# EasyEDA Pro project 魔方机器人 2.eprj

# Schematic 原理图
Create Date: 2024-04-21; Page Name: P1; Project Name: 魔方机器人 2; Schematic Name: 原理图; Update Date: 2024-06-26; Company: 广东海洋大学; Drawed: 何云峰; Page Size: A4; Version: V1.0
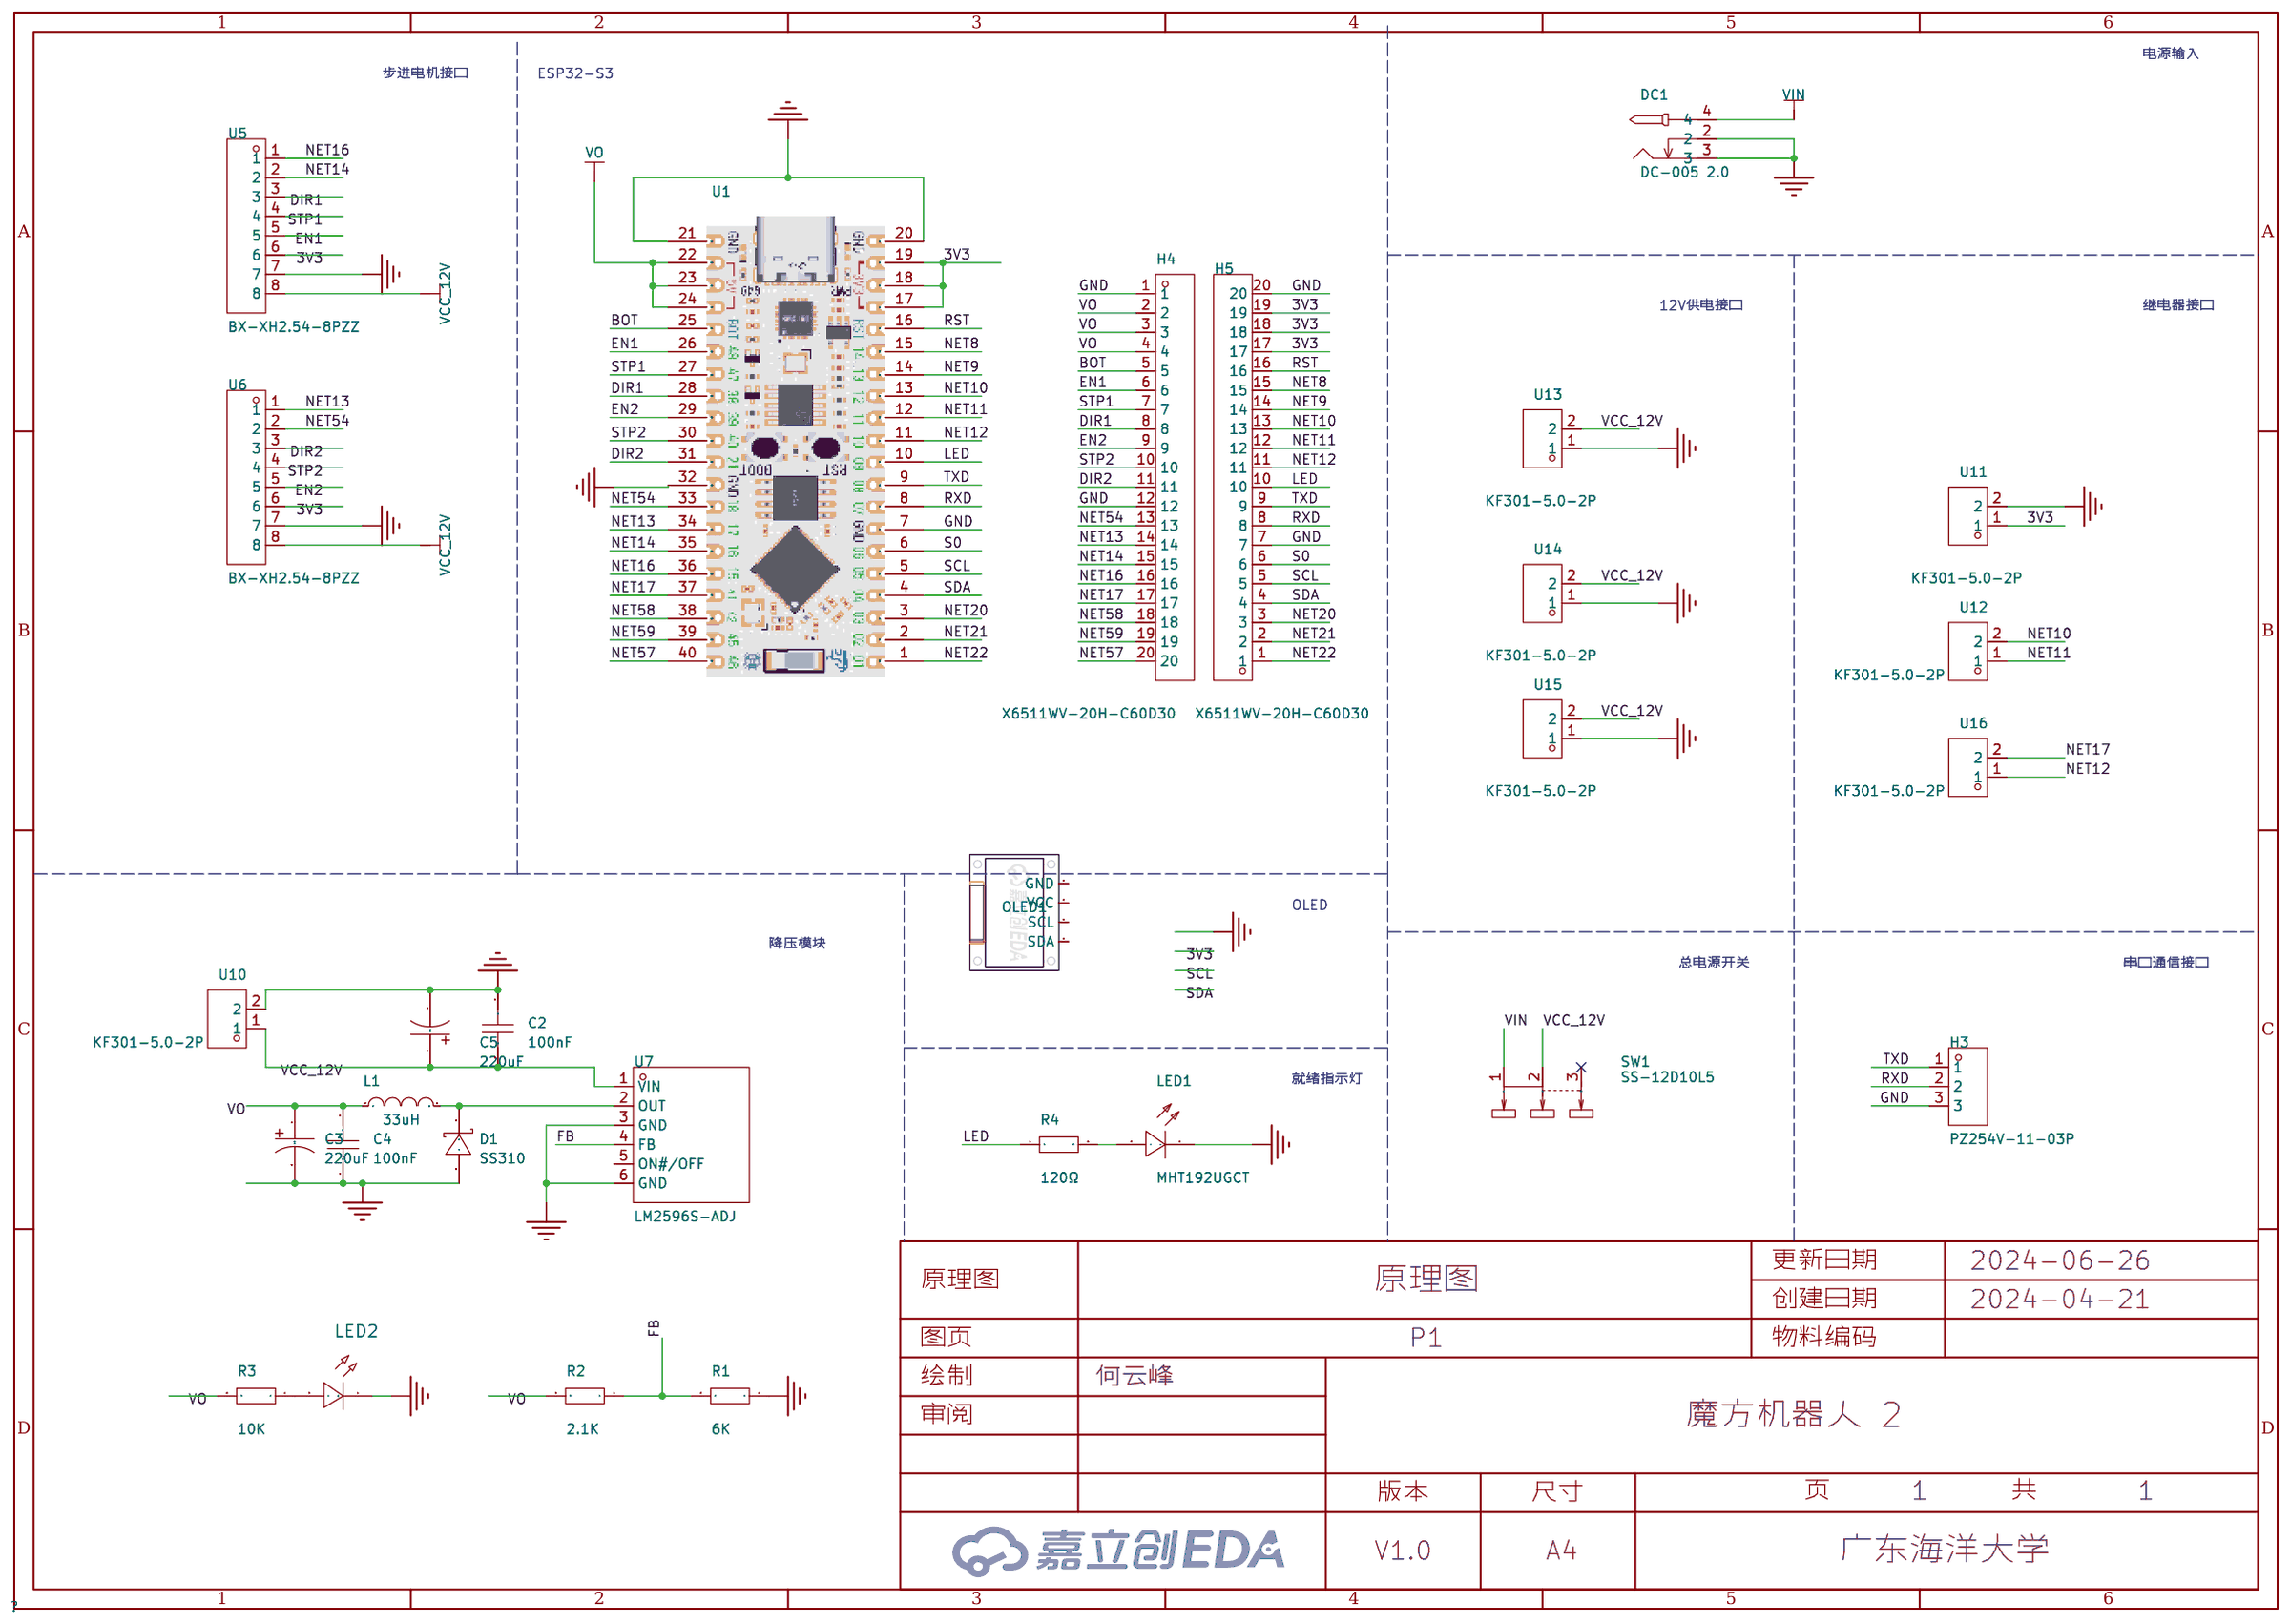
[diagram p0: schematic sheet]

## Parts
C2  100nF  [C0805]
C3  220uF  [CAP-SMD_BD8.0-L8.3-W8.3-FD]
C4  100nF  [C0805]
C5  220uF  [CAP-SMD_BD8.0-L8.3-W8.3-FD]
D1  SS310  [SMA_L4.3-W2.6-LS5.2-RD]
DC1  DC-005 2.0  [DC-IN-TH_DC-5520-1]
H3  PZ254V-11-03P  [HDR-TH_3P-P2.54-V-M]
H4  X6511WV-20H-C60D30  [HDR-TH_20P-P2.54-V-M]
H5  X6511WV-20H-C60D30  [HDR-TH_20P-P2.54-V-M]
L1  33uH  [IND-SMD_L7.0-W6.6_FXL0630]
LED1  MHT192UGCT  [LED0603-RD_GREEN]
LED2  -  [LED_0805]
OLED1  -  [0.96OLED_4P]
R1  6K  [R0805]
R2  2.1K  [R0805]
R3  10K  [R0805]
R4  120Ω  [R0603]
SW1  SS-12D10L5  [SW-TH_SS-12D10L5]
U1  -  [DIP-40_L20.32-W51.66-P2.54-LS15.24_OLD]
U5  BX-XH2.54-8PZZ  [CONN-TH_8P-P2.50_BX-XH2.54-8PZZ]
U6  BX-XH2.54-8PZZ  [CONN-TH_8P-P2.50_BX-XH2.54-8PZZ]
U7  LM2596S-ADJ  [TO-263-5_L10.2-W8.6-P1.70-LS14.4-BR]
U10  KF301-5.0-2P  [CONN-TH_P5.00_KF301-5.0-2P]
U11  KF301-5.0-2P  [CONN-TH_P5.00_KF301-5.0-2P]
U12  KF301-5.0-2P  [CONN-TH_P5.00_KF301-5.0-2P]
U13  KF301-5.0-2P  [CONN-TH_P5.00_KF301-5.0-2P]
U14  KF301-5.0-2P  [CONN-TH_P5.00_KF301-5.0-2P]
U15  KF301-5.0-2P  [CONN-TH_P5.00_KF301-5.0-2P]
U16  KF301-5.0-2P  [CONN-TH_P5.00_KF301-5.0-2P]

## Library data of the parts
C2 C4 = CAP_0805: Supplier Footprint: 0805
C3 C5 = EEEFP1V221AP: 容值:220uF;精度:±20%;额定电压:35V;电容体直径:8mm;电容体长度:10.2mm;纹波电流:-;等效串联电阻:-;工作寿命:2000hrs@105℃;工作温度:-45℃~+105℃;; LCSC Part Name: 220uF ±20% 35V; Supplier Part: C278406; Manufacturer: PANASONIC(松下); Supplier Footprint: SMD,8x10.2mm; JLCPCB Part Class: Extended Part; Datasheet: https://atta.szlcsc.com/upload/public/pdf/source/20181130/C278406_CB9CD87BC4579E70B6A89BF3334E5E7E.pdf; Supplier: LCSC; Tolerance: ±20%; Rated Voltage: 35V; φD: 8mm; L: 10.2mm; Lifetime @ Temp: 2000hrs@105℃; Operating Temperature: -45℃~+105℃
D1 = SS310_C15874: 直流反向耐压(Vr):100V;平均整流电流(Io):3A;正向压降(Vf):850mV@3A;; LCSC Part Name: 100V3A850mV@3A; Supplier Part: C15874; Manufacturer: MDD; Supplier Footprint: SMA(DO-214AC); JLCPCB Part Class: ExtendedPart; Datasheet: https://atta.szlcsc.com/upload/public/pdf/source/20230314/A80AE34493C69B89E2F4B1712F433538.pdf; Supplier: LCSC; Reverse Voltage (Vr): 100V; Average Rectified Current (Io): 3A; Forward Voltage (Vf@If): 850mV@3A
DC1 = DC-005 2.0: 连接器类型:DC电源插座;安装方式:弯插;触点内径:2mm;触点外径:6.4mm;额定电流:-;额定电压:-;工作温度范围:-;; LCSC Part Name: DC电源插座 内径:2mm 外径:6.4mm; Supplier Part: C16214; Manufacturer: BOOMELE(博穆精密); Supplier Footprint: 插件; JLCPCB Part Class: 扩展库; Datasheet: https://atta.szlcsc.com/upload/public/pdf/source/20230822/A395081E7D04348211A5D528B2AFD8E0.pdf; Supplier: LCSC; Connector Type: DC电源插座; Mounting Style: 弯插; Inside Contact Diameter: 2mm; Outside Contact Diameter: 6.4mm
H3 = PZ254V-11-03P: 插针结构:1x3P;间距:2.54mm;行距:-;圆针/方针:方针;安装类型:直插;排数:单排;总PIN位数:3P;额定电流:3A;额定电压:250V;配合针长度:6mm;塑高:2.5mm;端接针长度:3mm;工作温度范围:-40℃~+105℃;颜色:黑色;; LCSC Part Name: 间距:2.54mm 1x3P 直插 方针; Supplier Part: C2937625; Manufacturer: XFCN(兴飞); Supplier Footprint: 插件,P=2.54mm; JLCPCB Part Class: 扩展库; Datasheet: https://atta.szlcsc.com/upload/public/pdf/source/20200309/C492402_8335C3D49C4E4C618838D59BB1D024C1.pdf; Supplier: LCSC; Pin Structure: 1x3P; Pitch: 2.54mm; Circluar Pins/Square Pins: 方针; Mounting Type: 直插; Number of Rows: 单排; Number of Pins: 3P; Current Rating (Max): 3A; Voltage Rating (Max): 250V; Length of Mating Pin: 6mm; Insulation Height: 2.5mm; Length of End Connection Pin: 3mm; Operating Temperature Range: -40℃~+105℃; Color: 黑色
H4 H5 = X6511WV-20H-C60D30: 插针结构:1x20P;间距:2.54mm;行距:2.54mm;圆针/方针:方针;安装类型:-;排数:单排;总PIN位数:20P;额定电流:3A;额定电压:250V;配合针长度:6mm;塑高:2.5mm;端接针长度:3mm;触头材质:黄铜;触头镀层:金;工作温度范围:-40℃~+105℃;焊接温度(最大值):260℃;颜色:黑色;; LCSC Part Name: 1x20P 间距:2.54mm 方针; Supplier Part: C725952; Manufacturer: XKB Connection(中国星坤); Supplier Footprint: 插件,P=2.54mm; JLCPCB Part Class: 扩展库; Datasheet: https://atta.szlcsc.com/upload/public/pdf/source/20221108/2FDDF9C694C8EDC81165E23F2EAAE597.pdf; Supplier: LCSC; Pin Structure: 1x20P; Pitch: 2.54mm; Row Spacing: 2.54mm; Circluar Pins/Square Pins: 方针; Number of Rows: 单排; Number of Pins: 20P; Current Rating (Max): 3A; Voltage Rating (Max): 250V; Length of Mating Pin: 6mm; Insulation Height: 2.5mm; Length of End Connection Pin: 3mm; Contact Material: 黄铜; Contact Plating: 金; Operating Temperature Range: -40℃~+105℃; Soldering Temperature(Max): 260℃; Color: 黑色
L1 = FXL0630-330-M: 电感值:33uH;精度:±20%;额定电流:2A;饱和电流(Isat):2.5A;类型:一体成型电感;; LCSC Part Name: 33uH ±20% 2.5A; Supplier Part: C177245; Manufacturer: cjiang(长江微电); Supplier Footprint: SMD,6.6x7mm; JLCPCB Part Class: 扩展库; Datasheet: https://atta.szlcsc.com/upload/public/pdf/source/20230516/3A080F5AF8C87BB81C3BA86E5F60E51A.pdf; Supplier: LCSC; Tolerance: ±20%; Rated Current: 2A; Saturation Current (Isat): 2.5A; DC Resistance (DCR): 310mΩ; Type: 一体成型电感
LED1 = MHT192UGCT: 发光颜色:翠绿色;功率:60mW;正向电流:20mA;主波长:515nm~530nm;二极管配置:-;透镜颜色:无色透明透镜;色温:-;发光角度:120°;载带方式:-;工作温度:-40℃~+85℃;; LCSC Part Name: 翠绿; Supplier Part: C389519; Manufacturer: MEIHUA(美华); Supplier Footprint: 0603; JLCPCB Part Class: 扩展库; Datasheet: https://atta.szlcsc.com/upload/public/pdf/source/20190515/C389519_7BC27E831414348C8AF19AF18EE4BF58.pdf; Supplier: LCSC; Emitted Color: 翠绿色; Power Dissipation: 60mW; Forward Current: 20mA; Dominant Wavelength: 515nm~530nm; Peak Wavelength: 518nm; Lens Color: 无色透明透镜; Viewing Angle: 120°; Operating Temperature: -40℃~+85℃
LED2 = LED_0805-R: Supplier Footprint: 0805
OLED1 = 0.96OLED模块_4P: Supplier Footprint: 插件
R1-R3 = Res_0805: Supplier Footprint: 0805
R4 = 0603WAF1200T5E: 电阻类型:厚膜电阻;阻值:120Ω;精度:±1%;功率:100mW;最大工作电压:75V;温度系数:±100ppm/℃;; LCSC Part Name: 120Ω ±1% 100mW 厚膜电阻; Supplier Part: C22787; Manufacturer: UNI-ROYAL(厚声); Supplier Footprint: 0603; JLCPCB Part Class: 基础库; Datasheet: https://atta.szlcsc.com/upload/public/pdf/source/20200306/C422600_1E6D84923E4A46A82E41ADD87F860B5C.pdf; Supplier: LCSC; Type: 厚膜电阻; Tolerance: ±1%; Power(Watts): 100mW; Overload Voltage (Max): 75V; Temperature Coefficient: ±100ppm/℃; Operating Temperature Range: -55℃~+155℃
SW1 = SS-12D10L5: 电路结构:单刀双掷;安装方式:直插;开关颜色:黑色;额定电流(DC):3A;额定电压(DC):125V;额定电流(AC):3A;额定电压(AC):125V;机械寿命:1万次;; LCSC Part Name: 柄长5mm 直插双档 滑动开关; Supplier Part: C319012; Manufacturer: XKB Connectivity(中国星坤); Supplier Footprint: 插件; JLCPCB Part Class: 扩展库; Datasheet: https://atta.szlcsc.com/upload/public/pdf/source/20211009/D6412F37AABE6F9459A6EE7FA4DAEADB.pdf; Supplier: LCSC; Circuit: 单刀双掷; Actuator Style: 矩形柱状; Pin Style: PC引脚; Switch Length: 13mm; Switch Width: 6.8mm; Switch Height: 6.4mm; Mounting Style: 直插; Actuator Color: 黑色; Current Rating (DC): 3A; Voltage Rating (DC): 125V; Current Rating (AC): 3A; Voltage Rating (AC): 125V; Mechanical Life: 1万次; Operating Temperature: -40℃~+85℃
U1 = 立创·ESP32S3开发板: 立创·ESP32S3开发板正面芯片面
U5 U6 = BX-XH2.54-8PZZ: 插针结构:1x8P;间距:2.54mm;安装方式:直插;参考系列:XH;总PIN数:8P;排数:1;每排PIN数:8;行距:-;额定电流:3A;触头材质:黄铜;触头镀层:锡;工作温度范围:-25℃~+85℃;; Supplier Part: C18077839; Manufacturer: Bossie(博锡); Supplier Footprint: 插件,P=2.54mm; JLCPCB Part Class: 扩展库; Datasheet: https://atta.szlcsc.com/upload/public/pdf/source/20231017/CBB233C5B4BF7FAD492668A18B6464FA.pdf; Supplier: LCSC; Pins Structure: 1x8P; Pitch: 2.54mm; Mounting Style: 直插; Reference Series: XH; Number of Pins: 8P; Number of Rows: 1; Number of PINs Per Row: 8; Current Rating (Max): 3A; Contact Material: 黄铜; Contact Plating: 锡; Operating Temperature Range: -25℃~+85℃
U7 = LM2596S-ADJ_C5276751: Supplier Part: C5276751; Manufacturer: TWGMC(台湾迪嘉); Supplier Footprint: TO-263-5; JLCPCB Part Class: ExtendedPart; Datasheet: https://atta.szlcsc.com/upload/public/pdf/source/20221121/1586C0ED4283566B84D2D5018D7561E0.pdf; Supplier: LCSC
U10-U16 = KF301-5.0-2P: 结构:1x2P;间距:5mm;颜色:蓝色;安装方式:直插;额定电流:17A;额定电压:250V;排数:1;线规 - AWG:14~22;线规 - 平方毫米:1.5;每排PIN数:2;工作温度范围:-30℃~+120℃;; LCSC Part Name: 5mm 1x2P 排数:1 每排P数:2 直插; Supplier Part: C474881; Manufacturer: KEFA(科发); Supplier Footprint: 插件,P=5mm; JLCPCB Part Class: 扩展库; Datasheet: https://atta.szlcsc.com/upload/public/pdf/source/20230317/03A5B5FC229D6F9225E8F51DA1A4E80A.pdf; Supplier: LCSC; Structure: 1x2P; Pitch: 5mm; Color: 蓝色; Mounting Style: 直插; Current Rating (Max): 17A; Voltage Rating (Max): 250V; Number of Pins: 2P; Number of Rows: 1; Wire Gauge - AWG: 14~22; Wire Gauge - mm2: 1.5; Number of PINs Per Row: 2; Operating Temperature Range: -30℃~+120℃

## Nets
3V3: H5.17 H5.18 H5.19 U1.17(3V3) U1.18(3V3) U1.19(3V3) U5.6 U6.6 U11.1
GND: C2.1 C3.2 C4.1 C5.2 D1.2(A) DC1.2 DC1.3 H3.3 H4.1 H4.12 H5.7 H5.20 LED1.1(-) LED2.1(C) R1.1 U1.7(GND) U1.20(GND) U1.21(GND) U1.32(G08) U5.7 U6.7 U7.3(GND) U7.6(GND) U10.2 U11.2 U13.1 U14.1 U15.1
VCC_12V: C2.2 C5.1 SW1.2 U5.8 U6.8 U7.1(VIN) U10.1 U13.2 U14.2 U15.2
VIN: DC1.4 SW1.1
BOT: H4.5 U1.25(RST)
DIR1: H4.8 U1.28(G12) U5.3
DIR2: H4.11 U1.31(G09) U6.3
EN1: H4.6 U1.26(G14) U5.5
EN2: H4.9 U1.29(G11) U6.5
FB: R1.2 R2.1 U7.4(FB)
LED: H5.10 R4.1 U1.10(G09)
NET8: H5.15 U1.15(G14)
NET9: H5.14 U1.14(G13)
NET10: H5.13 U1.13(G12) U12.2
NET11: H5.12 U1.12(G11) U12.1
NET12: H5.11 U1.11(G10) U16.1
NET13: H4.14 U1.34(GND) U6.1
NET14: H4.15 U1.35(G06) U5.2
NET16: H4.16 U1.36(G05) U5.1
NET17: H4.17 U1.37(G04) U16.2
NET20: H5.3 U1.3(G03)
NET21: H5.2 U1.2(G02)
NET22: H5.1 U1.1(G01)
NET54: H4.13 U1.33(G07) U6.2
NET57: H4.20 U1.40(G01)
NET58: H4.18 U1.38(G03)
NET59: H4.19 U1.39(G02)
RST: H5.16 U1.16(RST)
RXD: H3.2 H5.8 U1.8(G07)
S0: H5.6 U1.6(G06)
SCL: H5.5 U1.5(G05)
SDA: H5.4 U1.4(G04)
STP1: H4.7 U1.27(G13) U5.4
STP2: H4.10 U1.30(G10) U6.4
TXD: H3.1 H5.9 U1.9(G08)
VO: C3.1 C4.2 H4.2 H4.3 H4.4 L1.1 R2.2 R3.2 U1.22(3V3) U1.23(3V3) U1.24(3V3)
$1N8325: LED2.2(A) R3.1
$1N10688: LED1.2(+) R4.2
$1N16622: D1.1(K) L1.2 U7.2(OUT)

Not connected (* = marked no-connect by the designer): OLED1 1(GND) 2(VCC) 3(SCL) 4(SDA); SW1 3*; U7 5(ON#/OFF)

## Notes on the sheet
- 电源输入
- 步进电机接口
- ESP32-S3
- 12V供电接口
- 继电器接口
- OLED
- 降压模块
- 总电源开关
- 串口通信接口
- 就绪指示灯

# Board PCB3
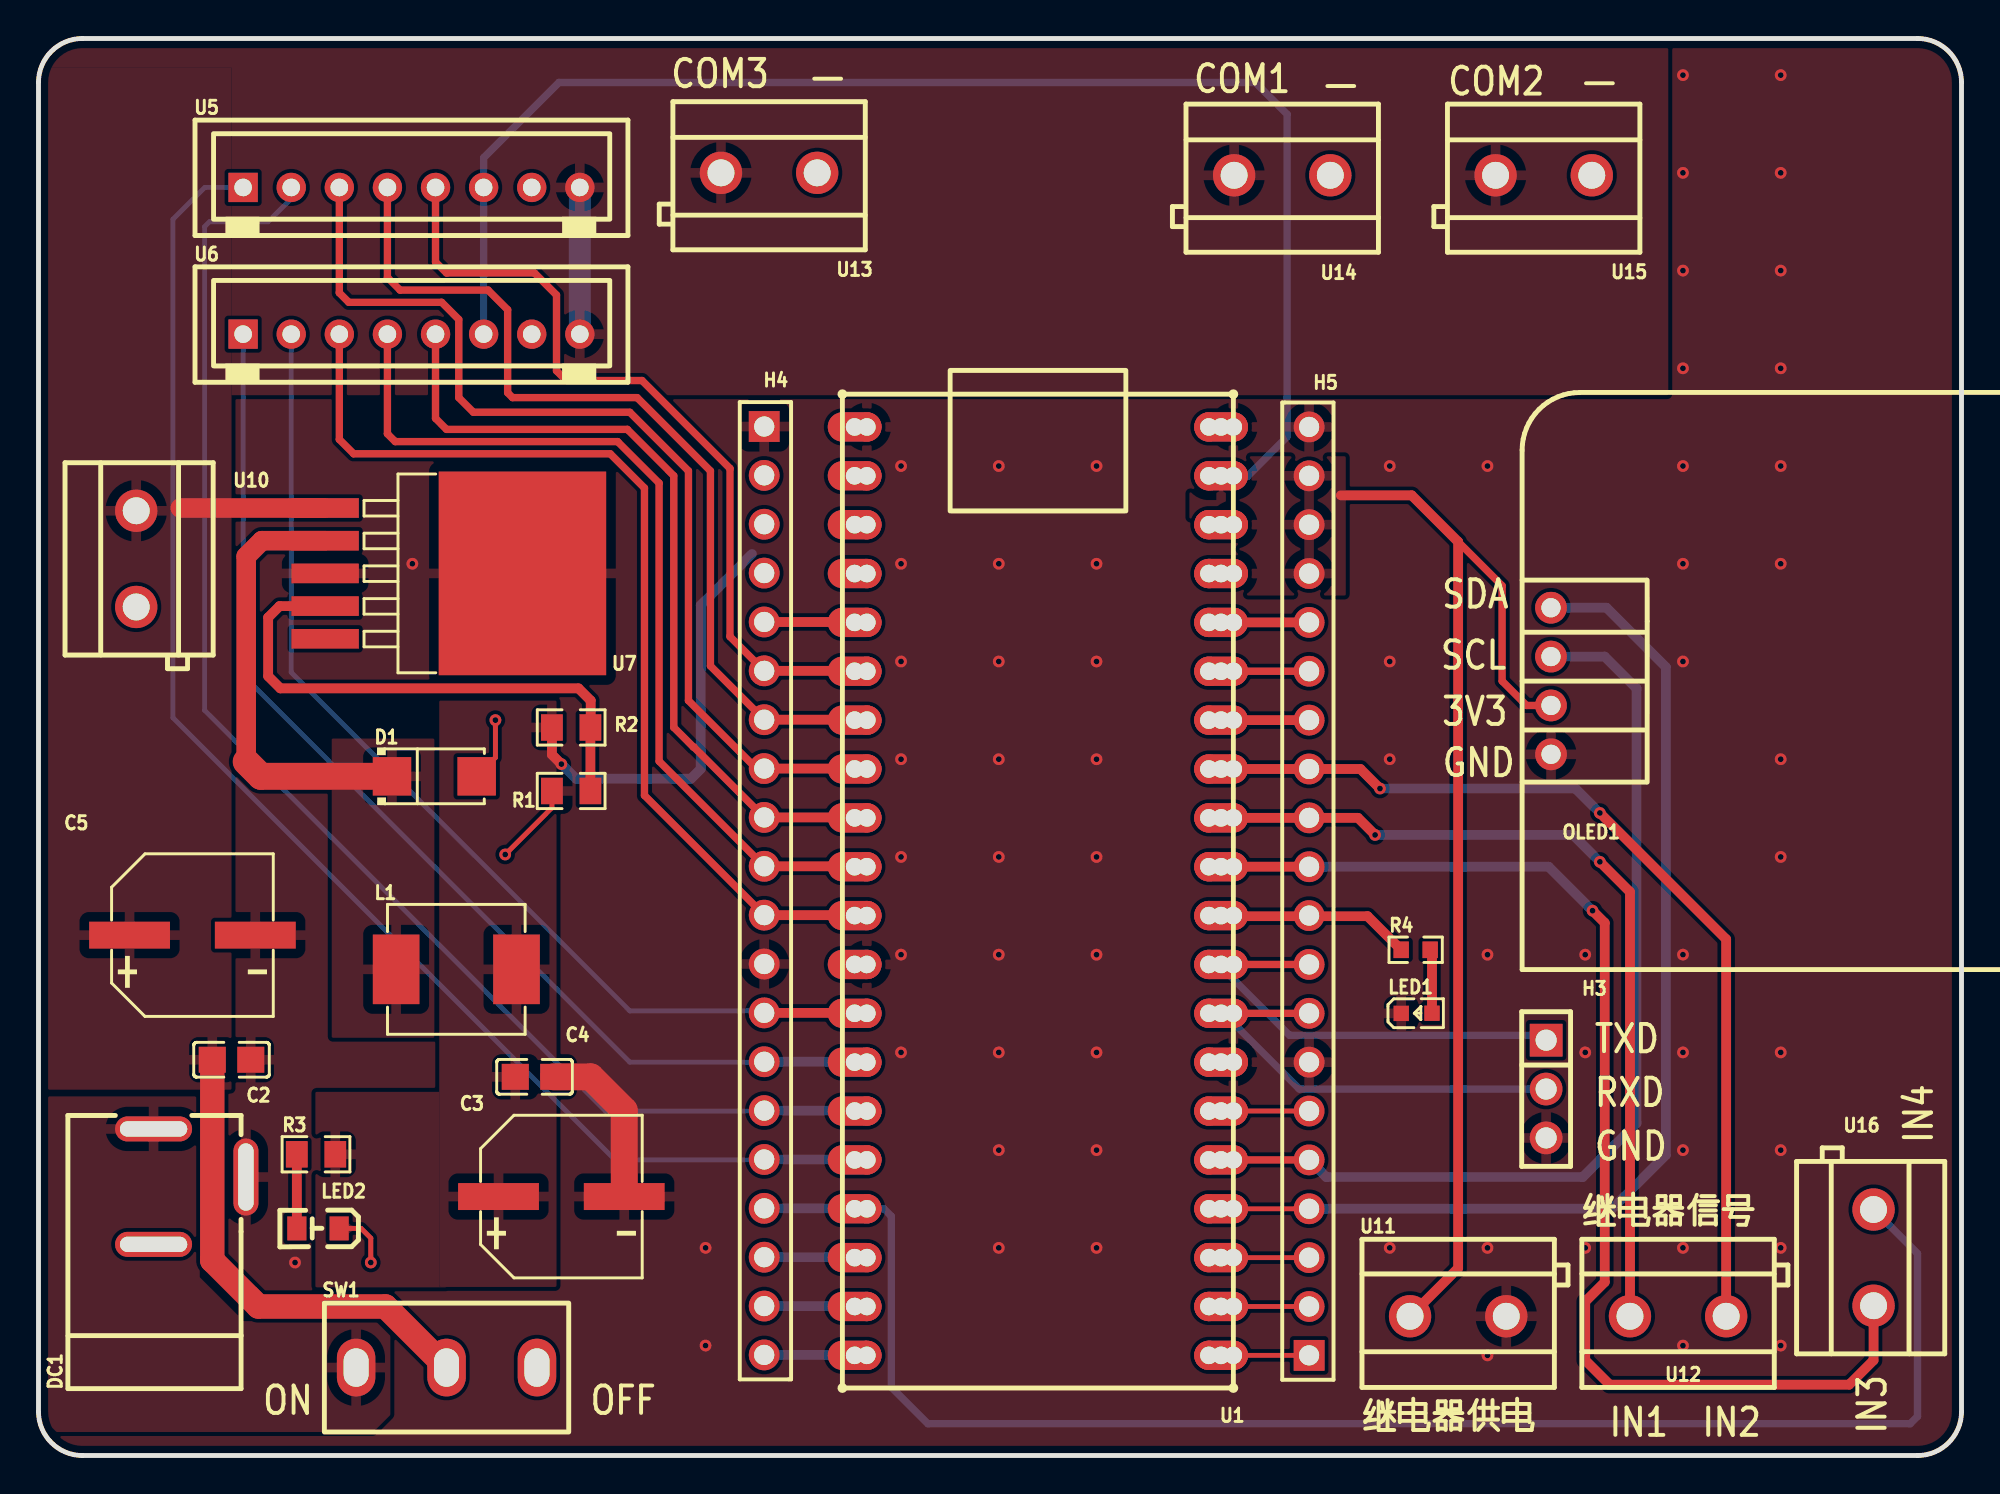
[diagram p1: board, top side]
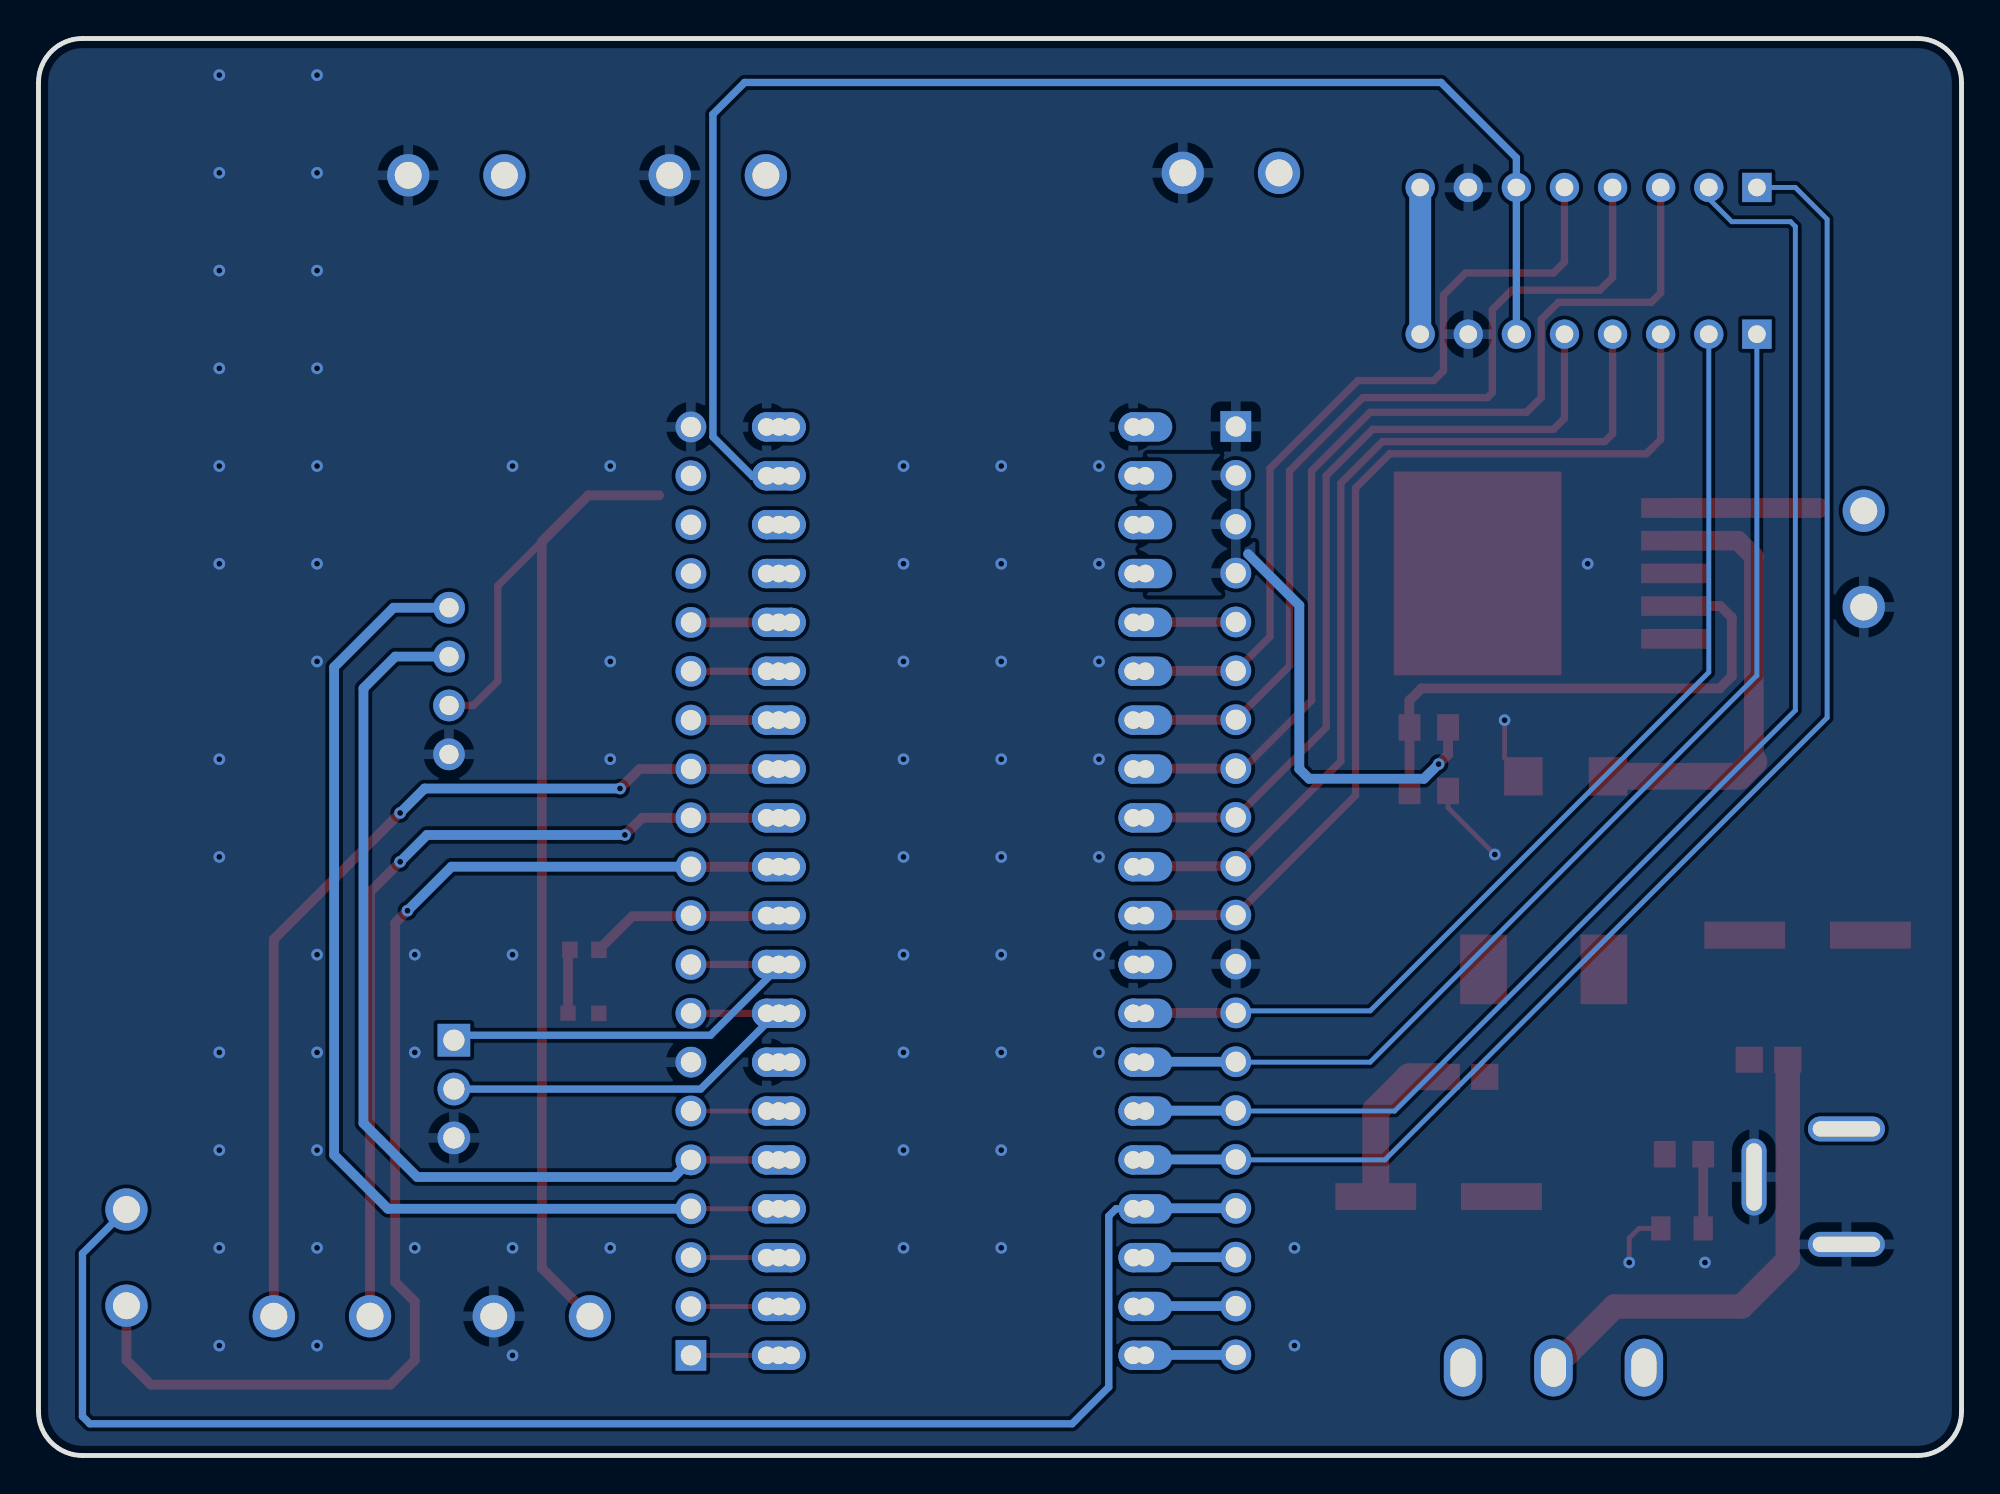
[diagram p2: board, bottom side, seen from below]

Outline 99.95 x 73.66 mm; copper layers: Top Layer, Bottom Layer. Coordinates in mm from the lower left corner of the outline.
Outline path: 0,71.37 0,2.29 arc(0.67,0.67) 2.29,0 97.66,0 arc(99.28,0.67) 99.95,2.29 99.95,71.37 arc(99.28,72.99) 97.66,73.66 2.29,73.66 arc(0.67,72.99) 0,71.37
Stack: Top Layer 0.035mm / Dielectric1 1.51mm FR4 er 4.5 / Bottom Layer 0.035mm

## Design rules (mm)
template: 自定义配置
spacing copperThickness1oz (default): track to track 0.102, other pairs 0.152 to 0.3
spacing copperThickness2oz: track to track 0.203, other pairs 0.152 to 0.3
track width copperThickness1oz (default): min 0.127, default 0.254, max 2.54
track width copperThickness2oz: min 0.203, default 0.254, max 2.54
differential pair differentialPair (default): width min 0.127, default 0.254, max 2.54; gap min 0.152, default 0.152
via viaSize (default): diameter min 0.5, default 0.61, max 10; hole min 0.3, default 0.305, max 6.3

## Placement (name value [footprint] x y rotation side)
C2  100nF  [C0805]  10.03 20.57 180 top
C3  220uF  [CAP-SMD_BD8.0-L8.3-W8.3-FD]  27.18 13.46 0 top
C4  100nF  [C0805]  25.78 19.68 180 top
C5  220uF  [CAP-SMD_BD8.0-L8.3-W8.3-FD]  8 27.05 0 top
D1  SS310  [SMA_L4.3-W2.6-LS5.2-RD]  20.57 35.31 0 top
DC1  DC-005 2.0  [DC-IN-TH_DC-5520-1]  8.38 13.98 90 top
H3  PZ254V-11-03P  [HDR-TH_3P-P2.54-V-M]  78.36 19.05 270 top
H4  X6511WV-20H-C60D30  [HDR-TH_20P-P2.54-V-M]  37.72 29.36 270 top
H5  X6511WV-20H-C60D30  [HDR-TH_20P-P2.54-V-M]  66.04 29.34 90 top
L1  33uH  [IND-SMD_L7.0-W6.6_FXL0630]  21.72 25.27 0 top
LED1  MHT192UGCT  [LED0603-RD_GREEN]  71.63 22.99 0 top
LED2  -  [LED_0805]  14.48 11.81 180 top
OLED1  -  [0.96OLED_4P]  78.61 40.26 90 top
R1  6K  [R0805]  27.69 34.54 0 top
R2  2.1K  [R0805]  27.69 37.85 180 top
R3  10K  [R0805]  14.42 15.66 0 top
R4  120Ω  [R0603]  71.58 26.29 0 top
SW1  SS-12D10L5  [SW-TH_SS-12D10L5]  21.21 4.57 0 top
U1  -  [DIP-40_L20.32-W51.66-P2.54-LS15.24_OLD]  62.1 3.51 180 top
U5  BX-XH2.54-8PZZ  [CONN-TH_8P-P2.50_BX-XH2.54-8PZZ]  19.39 65.92 0 top
U6  BX-XH2.54-8PZZ  [CONN-TH_8P-P2.50_BX-XH2.54-8PZZ]  19.39 58.29 0 top
U7  LM2596S-ADJ  [TO-263-5_L10.2-W8.6-P1.70-LS14.4-BR]  20.03 45.85 180 top
U10  KF301-5.0-2P  [CONN-TH_P5.00_KF301-5.0-2P]  5.08 46.61 270 top
U11  KF301-5.0-2P  [CONN-TH_P5.00_KF301-5.0-2P]  73.79 7.24 0 top
U12  KF301-5.0-2P  [CONN-TH_P5.00_KF301-5.0-2P]  85.22 7.24 0 top
U13  KF301-5.0-2P  [CONN-TH_P5.00_KF301-5.0-2P]  37.97 66.67 180 top
U14  KF301-5.0-2P  [CONN-TH_P5.00_KF301-5.0-2P]  64.64 66.55 180 top
U15  KF301-5.0-2P  [CONN-TH_P5.00_KF301-5.0-2P]  78.23 66.55 180 top
U16  KF301-5.0-2P  [CONN-TH_P5.00_KF301-5.0-2P]  95.38 10.29 90 top

## Footprints (pads in the part's own frame, mm; a bottom-side part is the same pattern mirrored in y, then rotated)
0.96OLED_4P
  round 1.65 hole 1: 1(-3.81,-0.002) 2(-1.27,0.002) 3(1.27,0.002) 4(3.81,0.002)
C0805
  rect 1.41x1.35 smd: 1(-1,0) 2(1,0)
CAP-SMD_BD8.0-L8.3-W8.3-FD
  rect 4.2x1.4 smd: 1(-3.267,0) 2(3.267,0)
CONN-TH_8P-P2.50_BX-XH2.54-8PZZ
  rect 1.524x1.524 hole 0.914: 1(-8.75,0)
  round 1.524 hole 0.914: 2(-6.25,0) 3(-3.75,0) 4(-1.25,0) 5(1.25,0) 6(3.75,0) 7(6.25,0) 8(8.75,0)
CONN-TH_P5.00_KF301-5.0-2P
  round 2.2 hole 1.4: 1(-2.5,0) 2(2.5,0)
DC-IN-TH_DC-5520-1
  oval 4x1.3 hole 3.5x0.8: 2(0.5,-2.4)
  oval 1.3x4 hole 0.8x3.5: 3(-3,2.4) 4(3,2.4)
DIP-40_L20.32-W51.66-P2.54-LS15.24_OLD
  round 1.524 hole 0.914: 1(0.002,-1.699) 1(1.272,-1.699) 2(0.002,-4.239) 2(1.272,-4.239) 3(0.002,-6.779) 3(1.272,-6.779) 4(0.002,-9.319) 4(1.272,-9.319) 5(0.002,-11.859) 5(1.272,-11.859) 6(0.002,-14.399) 6(1.272,-14.399) 7(0.002,-16.939) 7(1.272,-16.939) 8(0.002,-19.479) 8(1.272,-19.479) 9(0.002,-22.019) 9(1.272,-22.019) 10(0.002,-24.559) 10(1.272,-24.559) 11(0.002,-27.099) 11(1.272,-27.099) 12(0.002,-29.639) 12(1.272,-29.639) 13(0.002,-32.179) 13(1.272,-32.179) 14(0.002,-34.719) 14(1.272,-34.719) 15(0.002,-37.259) 15(1.272,-37.259) 16(0.002,-39.799) 16(1.272,-39.799) 17(0.002,-42.339) 17(1.272,-42.339) 18(0.002,-44.879) 18(1.272,-44.879) 19(0.002,-47.419) 19(1.272,-47.419) 20(0.002,-49.959) 20(1.272,-49.959) 21(19.049,-49.959) 22(19.049,-47.419) 23(19.049,-44.879) 24(19.049,-42.339) 25(19.049,-39.799) 26(19.049,-37.259) 27(19.049,-34.719) 28(19.049,-32.179) 29(19.049,-29.639) 30(19.049,-27.099) 31(19.049,-24.559) 32(19.049,-22.019) 33(19.049,-19.479) 34(19.049,-16.939) 35(19.049,-14.399) 36(19.049,-11.859) 37(19.049,-9.319) 38(19.049,-6.779) 39(19.049,-4.239) 40(19.049,-1.699)
  oval 2.794x1.524 hole 0.914: 1(0.637,-1.699) 2(0.637,-4.239) 3(0.637,-6.779) 4(0.637,-9.319) 5(0.637,-11.859) 6(0.637,-14.399) 7(0.637,-16.939) 8(0.637,-19.479) 9(0.637,-22.019) 10(0.637,-24.559) 11(0.637,-27.099) 12(0.637,-29.639) 13(0.637,-32.179) 14(0.637,-34.719) 14(0.637,-37.259) 16(0.637,-39.799) 17(0.637,-42.339) 18(0.637,-44.879) 19(0.637,-47.419) 20(0.637,-49.959) 21(19.684,-49.959) 22(19.684,-47.419) 23(19.684,-44.879) 24(19.684,-42.339) 25(19.684,-39.799) 26(19.684,-37.259) 27(19.684,-34.719) 28(19.684,-32.179) 29(19.684,-29.639) 30(19.684,-27.099) 31(19.684,-24.559) 32(19.684,-22.019) 33(19.684,-19.479) 34(19.684,-16.939) 35(19.684,-14.399) 36(19.684,-11.859) 37(19.684,-9.319) 38(19.684,-6.779) 39(19.684,-4.239) 40(19.684,-1.699)
HDR-TH_3P-P2.54-V-M
  rect 1.7x1.7 hole 1.1: 1(-2.54,0)
  round 1.7 hole 1.1: 2(0,0) 3(2.54,0)
HDR-TH_20P-P2.54-V-M
  rect 1.6x1.6 hole 1.05: 1(-24.13,0)
  round 1.6 hole 1.05: 2(-21.59,0) 3(-19.05,0) 4(-16.51,0) 5(-13.97,0) 6(-11.43,0) 7(-8.89,0) 8(-6.35,0) 9(-3.81,0) 10(-1.27,0) 11(1.27,0) 12(3.81,0) 13(6.35,0) 14(8.89,0) 15(11.43,0) 16(13.97,0) 17(16.51,0) 18(19.05,0) 19(21.59,0) 20(24.13,0)
IND-SMD_L7.0-W6.6_FXL0630
  rect 2.424x3.62 smd: 1(3.128,0) 2(-3.128,0)
LED0603-RD_GREEN
  rect 0.8x0.8 smd: 1(-0.799,-0.004) 2(0.799,0.004)
LED_0805
  rect 1x1.25 smd: 1(-1.15,0.005) 2(1.05,0.005)
R0603
  rect 0.806x0.864 smd: 1(-0.753,0) 2(0.753,0)
R0805
  rect 1.133x1.377 smd: 1(-1,0) 2(1,0)
SMA_L4.3-W2.6-LS5.2-RD
  rect 2x2 smd: 1(-2.2,0) 2(2.2,0)
SW-TH_SS-12D10L5
  oval 2x3 hole 1.3x2: 1(-4.7,0) 2(0,0) 3(4.7,0)
TO-263-5_L10.2-W8.6-P1.70-LS14.4-BR
  rect 3.5x1.02 smd: 1(5.127,-3.4) 2(5.127,-1.7) 3(5.127,0) 4(5.127,1.7) 5(5.127,3.4)
  rect 8.705x10.587 smd: 6(-5.127,0)

## Nets
As in the schematic, except:
3V3: H5.17 H5.18 H5.19 OLED1.2 U1.17 U1.18 U1.19 U5.6 U6.6 U11.1
GND: C2.1 C3.2 C4.1 C5.2 D1.2 DC1.2 DC1.3 H3.3 H4.1 H4.12 H5.7 H5.20 LED1.1 LED2.1 OLED1.1 R1.1 U1.7 U1.20 U1.21 U1.32 U5.7 U6.7 U7.3 U7.6 U10.2 U11.2 U13.1 U14.1 U15.1
SCL: H5.5 OLED1.3 U1.5
SDA: H5.4 OLED1.4 U1.4

Pads without a net: SW1 3; U7 5

## Via types
v1: diameter 0.61, hole 0.304, Top Layer to Bottom Layer, 65 vias
v2: diameter 0.61, hole 0.305, Top Layer to Bottom Layer, 8 vias

## Routing (per net, layer and track width the routed paths; a pad name or vN(x,y) marks a point on that pad's centre or on a via; arc(x,y) is an arc through that point)
3V3: length 133.3
  Top Layer w0.381: OLED1.2 77.34,38.99 76.07,40.26 76.07,45.21 73.79,47.5
  Top Layer w0.508: 67.69,49.91 71.37,49.91 73.79,47.5 73.79,9.74 U11.1
  Bottom Layer w0.381: U6.6 U5.6 23.14,67.46 27.05,71.37 63.25,71.37 64.9,69.72 64.9,52.96 62.83,50.9 62.1,50.9
GND: length 19.7
  Top Layer w0.254: D1.2 23.75,36.28 v2(23.75,38.23) ; LED2.1 16.77,11.81 17.27,11.3 v1(17.27,10.03) ; v2(24.26,31.24) 26.69,33.67 R1.1
  Top Layer w0.508: 42.37,25.55 42.42,25.5
  Top Layer w1.397: C3.2 30.44,17.94 28.7,19.68 C4.1
  vias: v1(13.33,10.03) v1(19.43,46.35) v1(34.67,10.79) v1(34.67,5.72) v1(44.83,51.43) v1(44.83,46.35) v1(44.83,41.27) v1(44.83,36.19) v1(44.83,31.11) v1(44.83,26.03) v1(44.83,20.95) v1(49.91,51.43) v1(49.91,46.35) v1(49.91,41.27) v1(49.91,36.19) v1(49.91,31.11) v1(49.91,26.03) v1(49.91,20.95) v1(49.91,15.87) v1(49.91,10.79) v1(54.99,51.43) v1(54.99,46.35) v1(54.99,41.27) v1(54.99,36.19) v1(54.99,31.11) v1(54.99,26.03) v1(54.99,20.95) v1(54.99,15.87) v1(54.99,10.79) v1(70.23,51.43) v1(70.23,41.27) v1(70.23,36.19) v1(70.23,10.79) v1(75.31,51.43) v1(75.31,26.03) v1(75.31,10.79) v1(75.31,5.21) v1(80.39,26.03) v1(80.39,20.95) v1(80.39,10.79) v1(85.47,71.75) v1(85.47,66.67) v1(85.47,61.59) v1(85.47,56.51) v1(85.47,51.43) v1(85.47,46.35) v1(85.47,41.27) v1(85.47,26.03) v1(85.47,20.95) v1(85.47,15.87) v1(85.47,10.79) v1(85.47,5.72) v1(90.55,71.75) v1(90.55,66.67) v1(90.55,61.59) v1(90.55,56.51) v1(90.55,51.43) v1(90.55,46.35) v1(90.55,36.19) v1(90.55,31.11) v1(90.55,20.95) v1(90.55,15.87) v1(90.55,10.79) v1(90.55,5.72)
VCC_12V: length 40.2
  Top Layer w1.016: U7.1 7.37,49.25
  Top Layer w1.27: SW1.2 18.03,7.75 11.43,7.75 9.03,10.14 C2.2
  Bottom Layer w1.143: 28.14,66.04 U6.8
BOT: length 4.7
  Top Layer w0.508: 42.42,43.28 42.37,43.33 H4.5
DIR1: length 52.5
  Top Layer w0.381: H4.8 37.32,35.71 33.78,39.24 33.78,51.18 30.73,54.23 22.61,54.23 21.84,54.99 21.84,59.05 20.95,59.94 16.13,59.94 15.64,60.44 U5.3
  Top Layer w0.508: 43.05,35.66 43,35.71 H4.8
DIR2: length 51.9
  Top Layer w0.254: 37.7,28.07 H4.11
  Top Layer w0.381: U6.3 15.64,52.82 16.38,52.07 29.72,52.07 31.5,50.29 31.5,34.31 H4.11
  Top Layer w0.508: 42.42,28.04 42.37,28.09 H4.11
EN1: length 41.9
  Top Layer w0.381: U5.5 20.64,62.04 21.21,61.47 25.78,61.47 26.92,60.32 26.92,56.39 27.43,55.88 31.37,55.88 35.94,51.31 35.94,42.57 H4.6
  Top Layer w0.508: H4.6 42.37,40.79 42.42,40.74
EN2: length 42.4
  Top Layer w0.381: U6.5 20.64,53.91 21.21,53.34 30.61,53.34 33.02,50.93 33.02,37.85 34.04,36.83 34.06,36.83 H4.9
  Top Layer w0.508: H4.9 42.37,33.17 42.42,33.12
FB: length 28.3
  Top Layer w0.508: U7.4 12.53,44.15 11.94,43.56 11.94,40.51 12.57,39.88 28.07,39.88 28.7,39.24 28.7,37.86 R2.1 R1.2
LED: length 9.4
  Top Layer w0.508: R4.1 69.08,28.04 62.1,28.04
NET8: length 5.2
  Top Layer w0.381: U1.15 U1.15 H5.15
NET9: length 5.2
  Top Layer w0.508: H5.14 U1.14 U1.14
NET10: length 48.9
  Top Layer w0.508: v2(69.72,34.67) 68.71,35.69 H5.13 U1.13 ; v2(81.15,33.4) 87.72,26.84 U12.2
  Bottom Layer w0.508: v2(81.15,33.4) 79.88,34.67 v2(69.72,34.67)
NET11: length 44.3
  Top Layer w0.508: v2(81.15,30.86) 82.72,29.3 U12.1 ; v2(69.47,32.26) 68.58,33.15 H5.12 U1.12
  Bottom Layer w0.508: v2(69.47,32.26) 79.76,32.26 v2(81.15,30.86)
NET12: length 62.5
  Top Layer w0.508: U16.1 95.38,4.95 94.11,3.68 81.66,3.68 80.39,4.95 80.39,8 81.41,9.02 81.41,27.69 v2(80.77,28.32) ; U1.11 H5.11
  Bottom Layer w0.508: v2(80.77,28.32) 78.49,30.61 H5.11
NET13: length 57.9
  Bottom Layer w0.254: H4.14 37.7,20.45 30.73,20.45 10.64,40.54 U6.1
  Bottom Layer w0.508: 42.42,20.42 42.37,20.47 H4.14
NET14: length 73.3
  Bottom Layer w0.254: H4.15 37.7,17.91 29.46,17.91 8.64,38.73 8.64,63.88 8.89,64.13 11.94,64.13 13.14,65.33 U5.2
  Bottom Layer w0.508: H4.15 42.37,17.93 42.42,17.88
NET16: length 75.9
  Bottom Layer w0.254: U5.1 8.64,65.92 6.98,64.26 6.98,38.35 29.97,15.37 37.7,15.37 H4.16
  Bottom Layer w0.508: 43.05,15.34 43,15.39 H4.16
NET17: length 81.7
  Bottom Layer w0.381: U1.37 43.94,12.83 44.32,12.45 44.32,3.56 46.23,1.65 97.28,1.65 97.66,2.03 97.66,10.5 U16.2
  Bottom Layer w0.508: 42.42,12.8 42.37,12.85 H4.17
NET20: length 3.9
  Top Layer w0.254: U1.3 H5.3
NET21: length 5.2
  Top Layer w0.254: U1.2 U1.2 H5.2
NET22: length 5.2
  Top Layer w0.254: U1.1 U1.1 H5.1
NET54: length 54.2
  Top Layer w0.508: 42.42,22.96 42.37,23.01 H4.13
  Bottom Layer w0.254: H4.13 37.61,23.11 30.73,23.11 13.14,40.71 U6.2
NET57: length 4.7
  Bottom Layer w0.508: 42.42,5.18 42.37,5.23 H4.20
NET58: length 5.4
  Bottom Layer w0.508: 43.05,10.26 43,10.31 H4.18
NET59: length 4.7
  Bottom Layer w0.508: H4.19 42.37,7.77 42.42,7.72
RST: length 5.2
  Top Layer w0.508: H5.16 U1.16 U1.16
RXD: length 22.7
  Top Layer w0.381: H5.8 U1.8
  Bottom Layer w0.381: 62.1,22.96 62.1,22.48 65.53,19.05 H3.2
S0: length 4
  Top Layer w0.254: 61.5,17.91 61.47,17.88 ; U1.6 H5.6
SCL: length 50.2
  Top Layer w0.381: U1.5 H5.5
  Bottom Layer w0.508: H5.5 66.93,14.48 80.26,14.48 83.06,17.27 83.06,39.88 81.41,41.53 78.61,41.53
SDA: length 57.5
  Top Layer w0.254: U1.4 U1.4 H5.4
  Bottom Layer w0.508: H5.4 81.79,12.83 84.58,15.62 84.58,40.98 81.5,44.07 OLED1.4
STP1: length 47
  Top Layer w0.381: H4.7 34.92,41.04 34.92,51.18 31.11,54.99 24.64,54.99 24.38,55.24 24.38,59.56 23.37,60.58 18.8,60.58 18.14,61.24 U5.4
  Top Layer w0.508: 42.42,38.2 42.37,38.25 H4.7
STP2: length 47.9
  Top Layer w0.381: U6.4 18.14,53.11 18.54,52.7 30.1,52.7 32.26,50.55 32.26,36.09 H4.10
  Top Layer w0.508: 43.05,30.58 43,30.63 H4.10
TXD: length 23.1
  Top Layer w0.381: U1.9 H5.9
  Bottom Layer w0.381: 60.83,25.5 61.37,25.5 65.02,21.84 78.1,21.84 H3.1
VO: length 22.3
  Top Layer w0.508: R2.2 26.69,36.43 v2(27.18,35.94) ; 42.37,48.41 42.42,48.36 ; 42.37,50.95 42.42,50.9
  Bottom Layer w0.508: 37.08,46.86 34.42,44.2 34.42,35.69 33.91,35.18 27.94,35.18 v2(27.18,35.94)
$1N8325: length 3.9
  Top Layer w0.508: LED2.2 13.43,15.65 R3.1
$1N10688: length 3.3
  Top Layer w0.508: R4.2 72.43,26.19 LED1.2
$1N16622: length 23
  Top Layer w1.016: 10.8,36.07 10.8,46.74 11.61,47.55 U7.2
  Top Layer w1.397: 10.8,36.07 11.56,35.31 D1.1

## Copper pours and planes (outline as drawn; the poured copper is in the pictures)
3V3 on Top Layer: 59.82,51.94 67.94,51.94 67.94,44.7 59.82,44.7
GND on Top Layer: -4.7,81.15 103.76,81.15 103.76,-3.3 -4.7,-3.3
GND on Bottom Layer: -2.16,77.72 108.59,77.72 108.59,-11.05 -2.16,-11.05
VCC_12V on Top Layer: 0.38,72.14 10.03,72.14 10.03,19.02 0.38,19.02
VCC_12V on Top Layer: 0.38,76.07 84.71,76.07 84.71,55.12 0.38,55.12
VIN on Top Layer: 0.38,18.67 8.38,18.67 8.38,9.27 10.67,6.98 17.53,6.98 18.29,6.22 18.29,2.11 17.4,1.22 0.94,1.22 0.38,1.78
VO on Top Layer: 20.83,39.24 26.92,39.24 26.92,8.76 20.83,8.76
VO on Top Layer: 14.39,18.9 21.21,18.9 21.21,8.74 14.39,8.74
VO on Bottom Layer: 36.7,52.07 44.07,52.07 44.07,44.7 36.7,44.7
$1N16622 on Top Layer: 15.24,37.27 20.57,37.27 20.57,21.72 15.24,21.72

## Text on the board
Top Silkscreen Layer: COM1 | COM2 | ON | OFF | COM3 | SCL | SDA | 3V3 | GND | TXD | RXD | IN1 | IN2 | IN3 | IN4 | - | 继电器供电 | 继电器信号
